# Altium schematic sheet Accelerometer.SchDoc
size A4; SheetNumber: 9; SheetTotal: 9
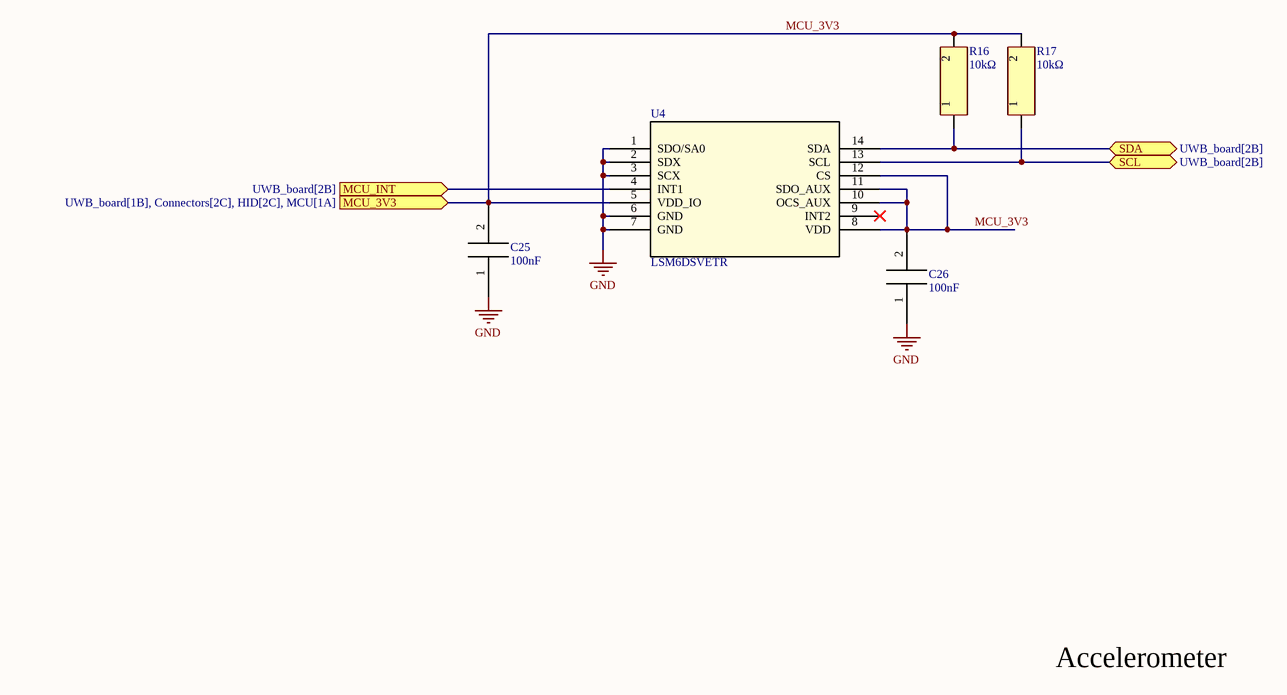
[diagram p0: Accelerometer.SchDoc]

## Parts
C25  100nF  [0603_cap]
C26  100nF  [0603_cap]
R16  value 10kΩ  [0603_res]  (hidden comment: 10k)
R17  value 10kΩ  [0603_res]  (hidden comment: 10k)
U4  LSM6DSVETR  [LGA14-L_2p59x3P1x0P5_STM]

## Ports
MCU_3V3 (in, see UWB_board[1B], Connectors[2C], HID[2C], MCU[1A]), MCU_INT (in, see UWB_board[2B]), SCL (bidir, see UWB_board[2B]), SDA (bidir, see UWB_board[2B])

## Nets
GND: C25.1 C26.1 U4.1(SDO/SA0) U4.2(SDX) U4.3(SCX) U4.6(GND) U4.7(GND)
MCU_3V3: C25.2 C26.2 R16.2 R17.2 U4.5(VDD_IO) U4.8(VDD) U4.10(OCS_AUX) U4.11(SDO_AUX) U4.12(CS) ; port MCU_3V3
MCU_INT: U4.4(INT1) ; port MCU_INT
SCL: R17.1 U4.13(SCL) ; port SCL
SDA: R16.1 U4.14(SDA) ; port SDA

Not connected (* = marked no-connect by the designer): U4 9(INT2)*

## Notes on the sheet
- Accelerometer

## Library data of the parts
C25 C26 = CC0603KRX7R9BB104: 100nF 50V X7R ±10% 0603 Multilayer Ceramic Capacitors MLCC - SMD/SMT ROHS; LCSC Part #: C14663; Value: 100nF
R16 R17 = 0603WAF1002T5E: 10kΩ -55℃~+155℃ 100mW 75V Thick Film Resistor ±1% ±100ppm/℃ 0603 Chip Resistor - Surface Mount ROHS; LCSC Part #: C25804
U4 = LSM6DSVETR: 6-axis IMU with embedded sensor fusion, I3C, OIS/EIS for smart applications; LCSC Part #: C41785564